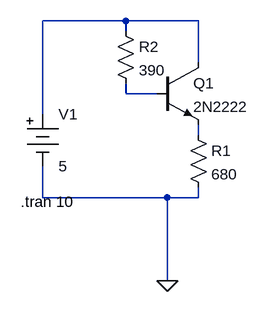
[diagram p0: schematic 2n2222-switch.asc]
2n2222-switch.asc, the LTspice schematic file:
Version 4
SHEET 1 880 680
WIRE 144 -48 16 -48
WIRE 256 -48 144 -48
WIRE 144 -32 144 -48
WIRE 256 16 256 -48
WIRE 144 64 144 48
WIRE 192 64 144 64
WIRE 16 96 16 -48
WIRE 256 128 256 112
WIRE 16 224 16 176
WIRE 208 224 16 224
WIRE 256 224 256 208
WIRE 256 224 208 224
WIRE 208 352 208 224
FLAG 208 352 0
SYMBOL Misc\\battery 16 80 R0
WINDOW 123 0 0 Left 0
WINDOW 39 0 0 Left 0
SYMATTR InstName V1
SYMATTR Value 5
SYMBOL npn2 192 16 R0
SYMATTR InstName Q1
SYMATTR Value 2N2222
SYMBOL res 240 112 R0
SYMATTR InstName R1
SYMATTR Value 680
SYMBOL res 128 -48 R0
SYMATTR InstName R2
SYMATTR Value 390
TEXT -18 230 Left 2 !.tran 10

The netlist it stands for:
* 2n2222-switch.asc
V1 N001 0 5
Q1 N001 N002 N003 0 2N2222
R1 N003 0 680
R2 N001 N002 390
.model NPN NPN
.model PNP PNP
.lib standard.bjt
.tran 10
.backanno
.end